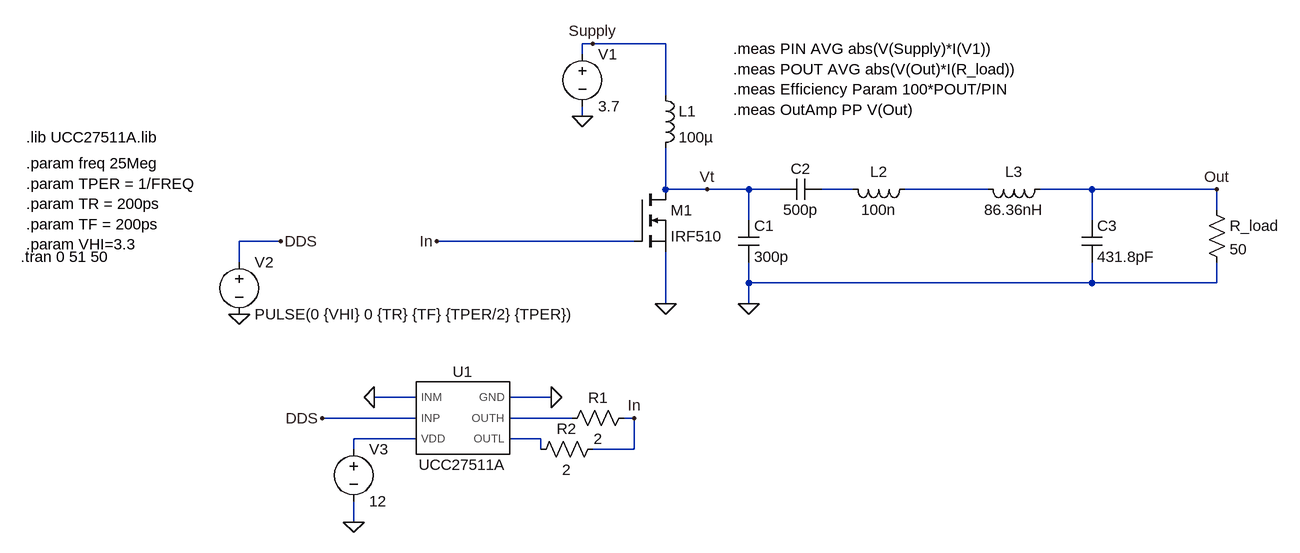
[diagram p0: schematic Class_E+Driver.asc]
Class_E+Driver.asc, the LTspice schematic file:
Version 4
SHEET 1 1096 800
WIRE 32 -96 16 -96
WIRE 144 -96 32 -96
WIRE 16 -80 16 -96
WIRE 144 -16 144 -96
WIRE 16 16 16 0
WIRE 144 128 144 64
WIRE 208 128 144 128
WIRE 272 128 208 128
WIRE 320 128 272 128
WIRE 432 128 384 128
WIRE 640 128 512 128
WIRE 800 128 720 128
WIRE 992 128 800 128
WIRE 992 160 992 128
WIRE 272 176 272 128
WIRE 800 176 800 128
WIRE -448 208 -512 208
WIRE 96 208 -208 208
WIRE -512 240 -512 208
WIRE 272 272 272 240
WIRE 800 272 800 240
WIRE 800 272 272 272
WIRE 992 272 992 240
WIRE 992 272 800 272
WIRE 144 304 144 224
WIRE 272 304 272 272
WIRE -240 448 -304 448
WIRE -32 448 -96 448
WIRE -240 480 -384 480
WIRE 0 480 -96 480
WIRE 96 480 80 480
WIRE -240 512 -336 512
WIRE -48 512 -96 512
WIRE -336 528 -336 512
WIRE -48 528 -48 512
WIRE 96 528 96 480
WIRE 96 528 32 528
WIRE -336 640 -336 608
FLAG 16 16 0
FLAG -512 320 0
FLAG 272 304 0
FLAG -208 208 In
FLAG 208 128 Vt
FLAG 32 -96 Supply
FLAG 144 304 0
FLAG 992 128 Out
FLAG -448 208 DDS
FLAG -304 448 0
FLAG -32 448 0
FLAG -384 480 DDS
FLAG 96 480 In
FLAG -336 640 0
SYMBOL voltage 16 -96 R0
WINDOW 123 0 0 Left 0
WINDOW 39 0 0 Left 0
SYMATTR InstName V1
SYMATTR Value 3.7
SYMBOL voltage -512 224 R0
WINDOW 123 0 0 Left 0
WINDOW 39 0 0 Left 0
SYMATTR InstName V2
SYMATTR Value PULSE(0 {VHI} 0 {TR} {TF} {TPER/2} {TPER})
SYMBOL ind 128 -32 R0
SYMATTR InstName L1
SYMATTR Value 100µ
SYMBOL cap 384 112 R90
WINDOW 0 0 32 VBottom 2
WINDOW 3 32 32 VTop 2
SYMATTR InstName C2
SYMATTR Value 500p
SYMBOL ind 528 112 R90
WINDOW 0 5 56 VBottom 2
WINDOW 3 32 56 VTop 2
SYMATTR InstName L2
SYMATTR Value 100n
SYMBOL nmos 96 128 R0
SYMATTR InstName M1
SYMATTR Value IRF510
SYMBOL cap 256 176 R0
SYMATTR InstName C1
SYMATTR Value 300p
SYMBOL ind 736 112 R90
WINDOW 0 5 56 VBottom 2
WINDOW 3 32 56 VTop 2
SYMATTR InstName L3
SYMATTR Value 86.36nH
SYMBOL cap 784 176 R0
SYMATTR InstName C3
SYMATTR Value 431.8pF
SYMBOL res 976 144 R0
SYMATTR InstName R_load
SYMATTR Value 50
SYMBOL UCC27511A -176 480 R0
SYMATTR InstName U1
SYMBOL voltage -336 512 R0
SYMATTR InstName V3
SYMATTR Value 12
SYMBOL res 96 464 R90
WINDOW 0 0 56 VBottom 2
WINDOW 3 32 56 VTop 2
SYMATTR InstName R1
SYMATTR Value 2
SYMBOL res 48 512 R90
WINDOW 0 0 56 VBottom 2
WINDOW 3 32 56 VTop 2
SYMATTR InstName R2
SYMATTR Value 2
TEXT -848 232 Left 2 !.tran 0 51 50
TEXT -840 88 Left 2 !.param freq 25Meg\n.param TPER = 1/FREQ\n.param TR = 200ps\n.param TF = 200ps\n.param VHI=3.3
TEXT 248 -88 Left 2 !.meas PIN AVG abs(V(Supply)*I(V1))\n.meas POUT AVG abs(V(Out)*I(R_load))\n.meas Efficiency Param 100*POUT/PIN\n.meas OutAmp PP V(Out)
TEXT -840 48 Left 2 !.lib UCC27511A.lib

The netlist it stands for:
* Class_E+Driver.asc
V1 Supply 0 3.7
V2 DDS 0 PULSE(0 {VHI} 0 {TR} {TF} {TPER/2} {TPER})
L1 Supply Vt 100µ
C2 N001 Vt 500p
L2 N002 N001 100n
M1 Vt In 0 0 IRF510
C1 Vt 0 300p
L3 Out N002 86.36nH
C3 Out 0 431.8pF
R_load Out 0 50
XU1 0 DDS N004 0 N003 N005 UCC27511A  ; pins INM INP VDD GND OUTH OUTL
V3 N004 0 12
R1 In N003 2
R2 In N005 2
.model NMOS NMOS
.model PMOS PMOS
.lib standard.mos
.tran 0 51 50
.param freq 25Meg
.param TPER = 1/FREQ
.param TR = 200ps
.param TF = 200ps
.param VHI=3.3
.meas PIN AVG abs(V(Supply)*I(V1))
.meas POUT AVG abs(V(Out)*I(R_load))
.meas Efficiency Param 100*POUT/PIN
.meas OutAmp PP V(Out)
.lib UCC27511A.lib
.lib UCC27511A.lib
.backanno
.end